# Altium schematic sheet 通用工装板02.SchDoc
size A2; Date: 20190212; CompanyName: 瑞臻信息（深圳）有限公司; DrawnBy: bob.xu; Address1: 深圳市南山区深南路万利达大厦2201室; Address2: 昆山市花桥镇花桥国际商务城绿地大道231弄9号楼杰座大厦2111室; Address3: 成都市高新区天府二街138号蜀都中心3号楼3110室; Address4: 浙江省宁波市余姚市冶山路475号1401室; Revision: V1.00; SheetOf: 2/3; ProductTitle: 通用测试工装; ModuleTitle: IO; : CheckedBy
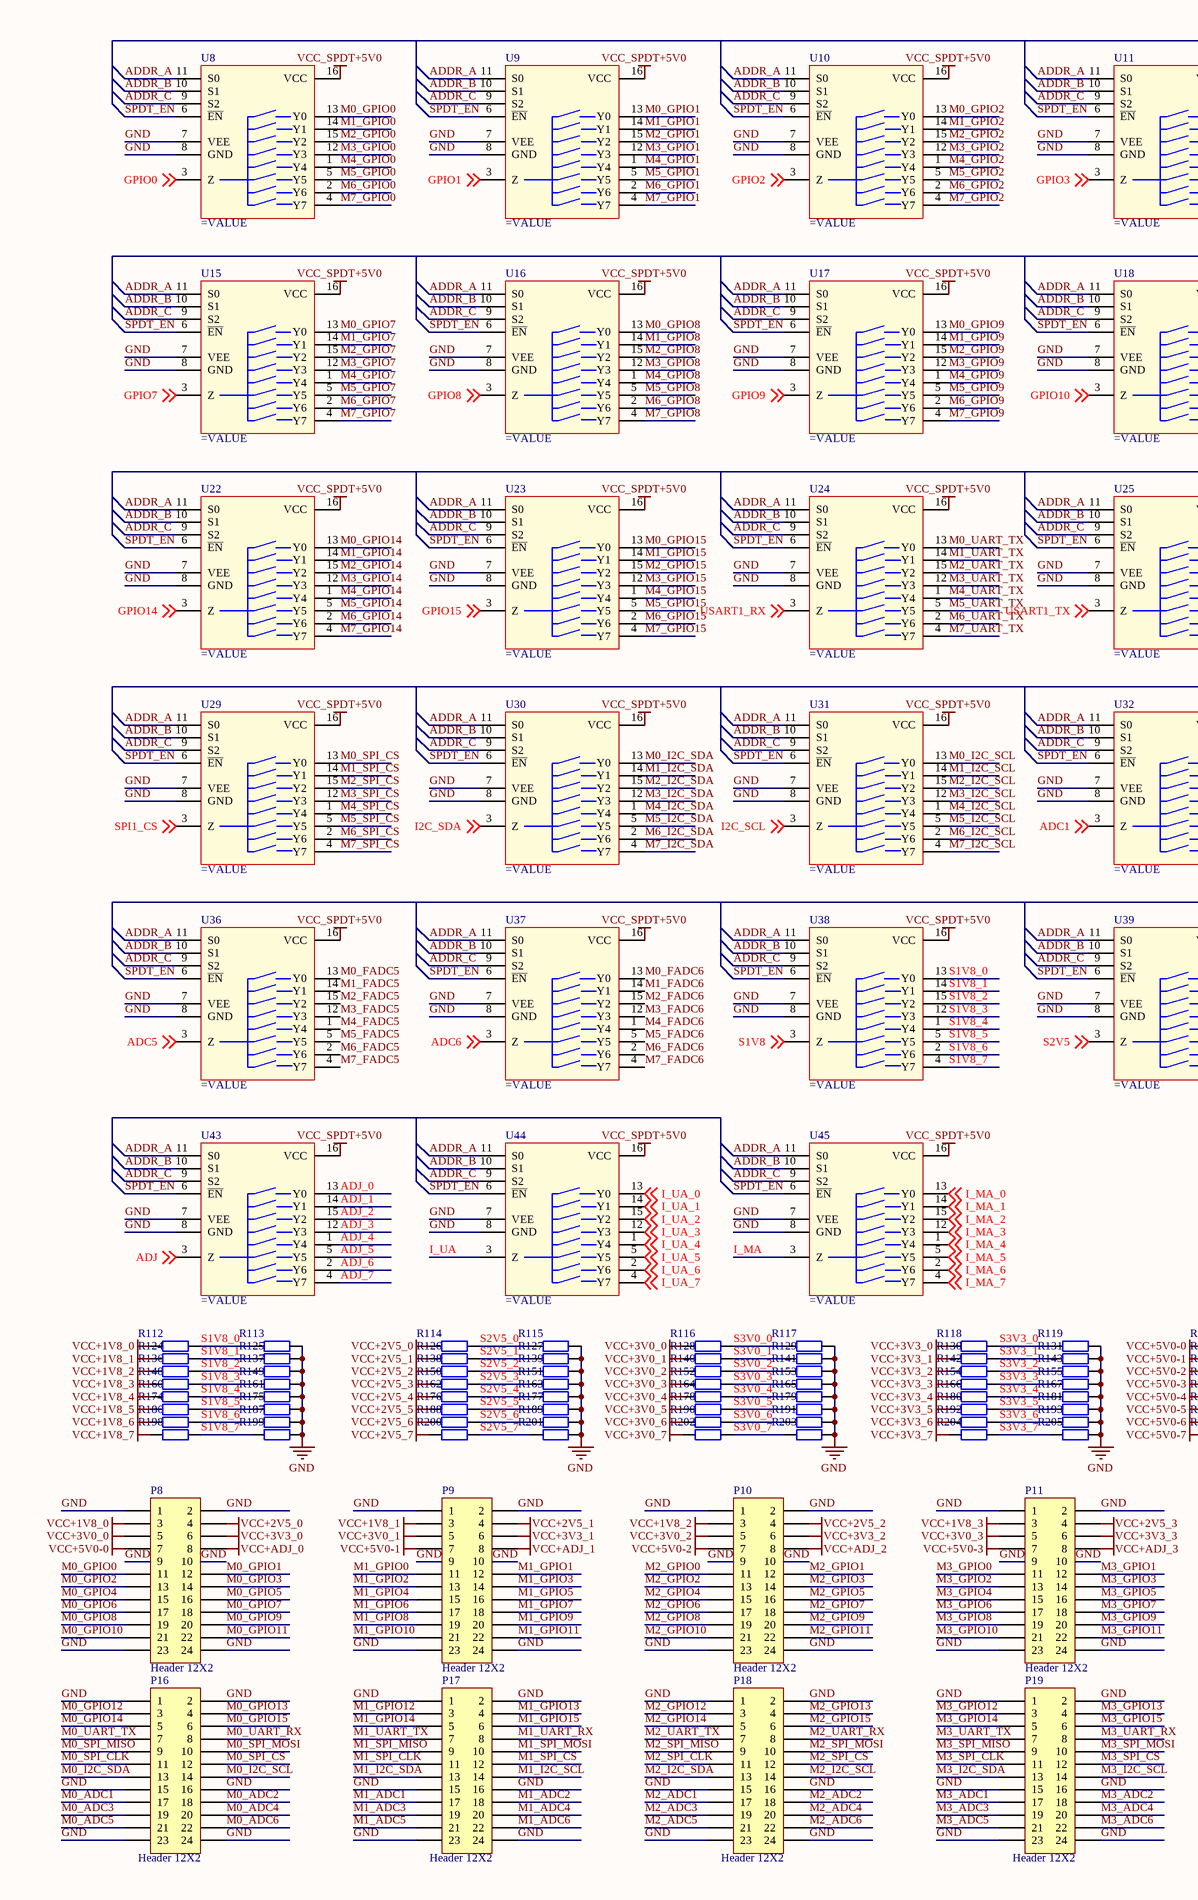
[diagram p0: 通用工装板02.SchDoc, left]
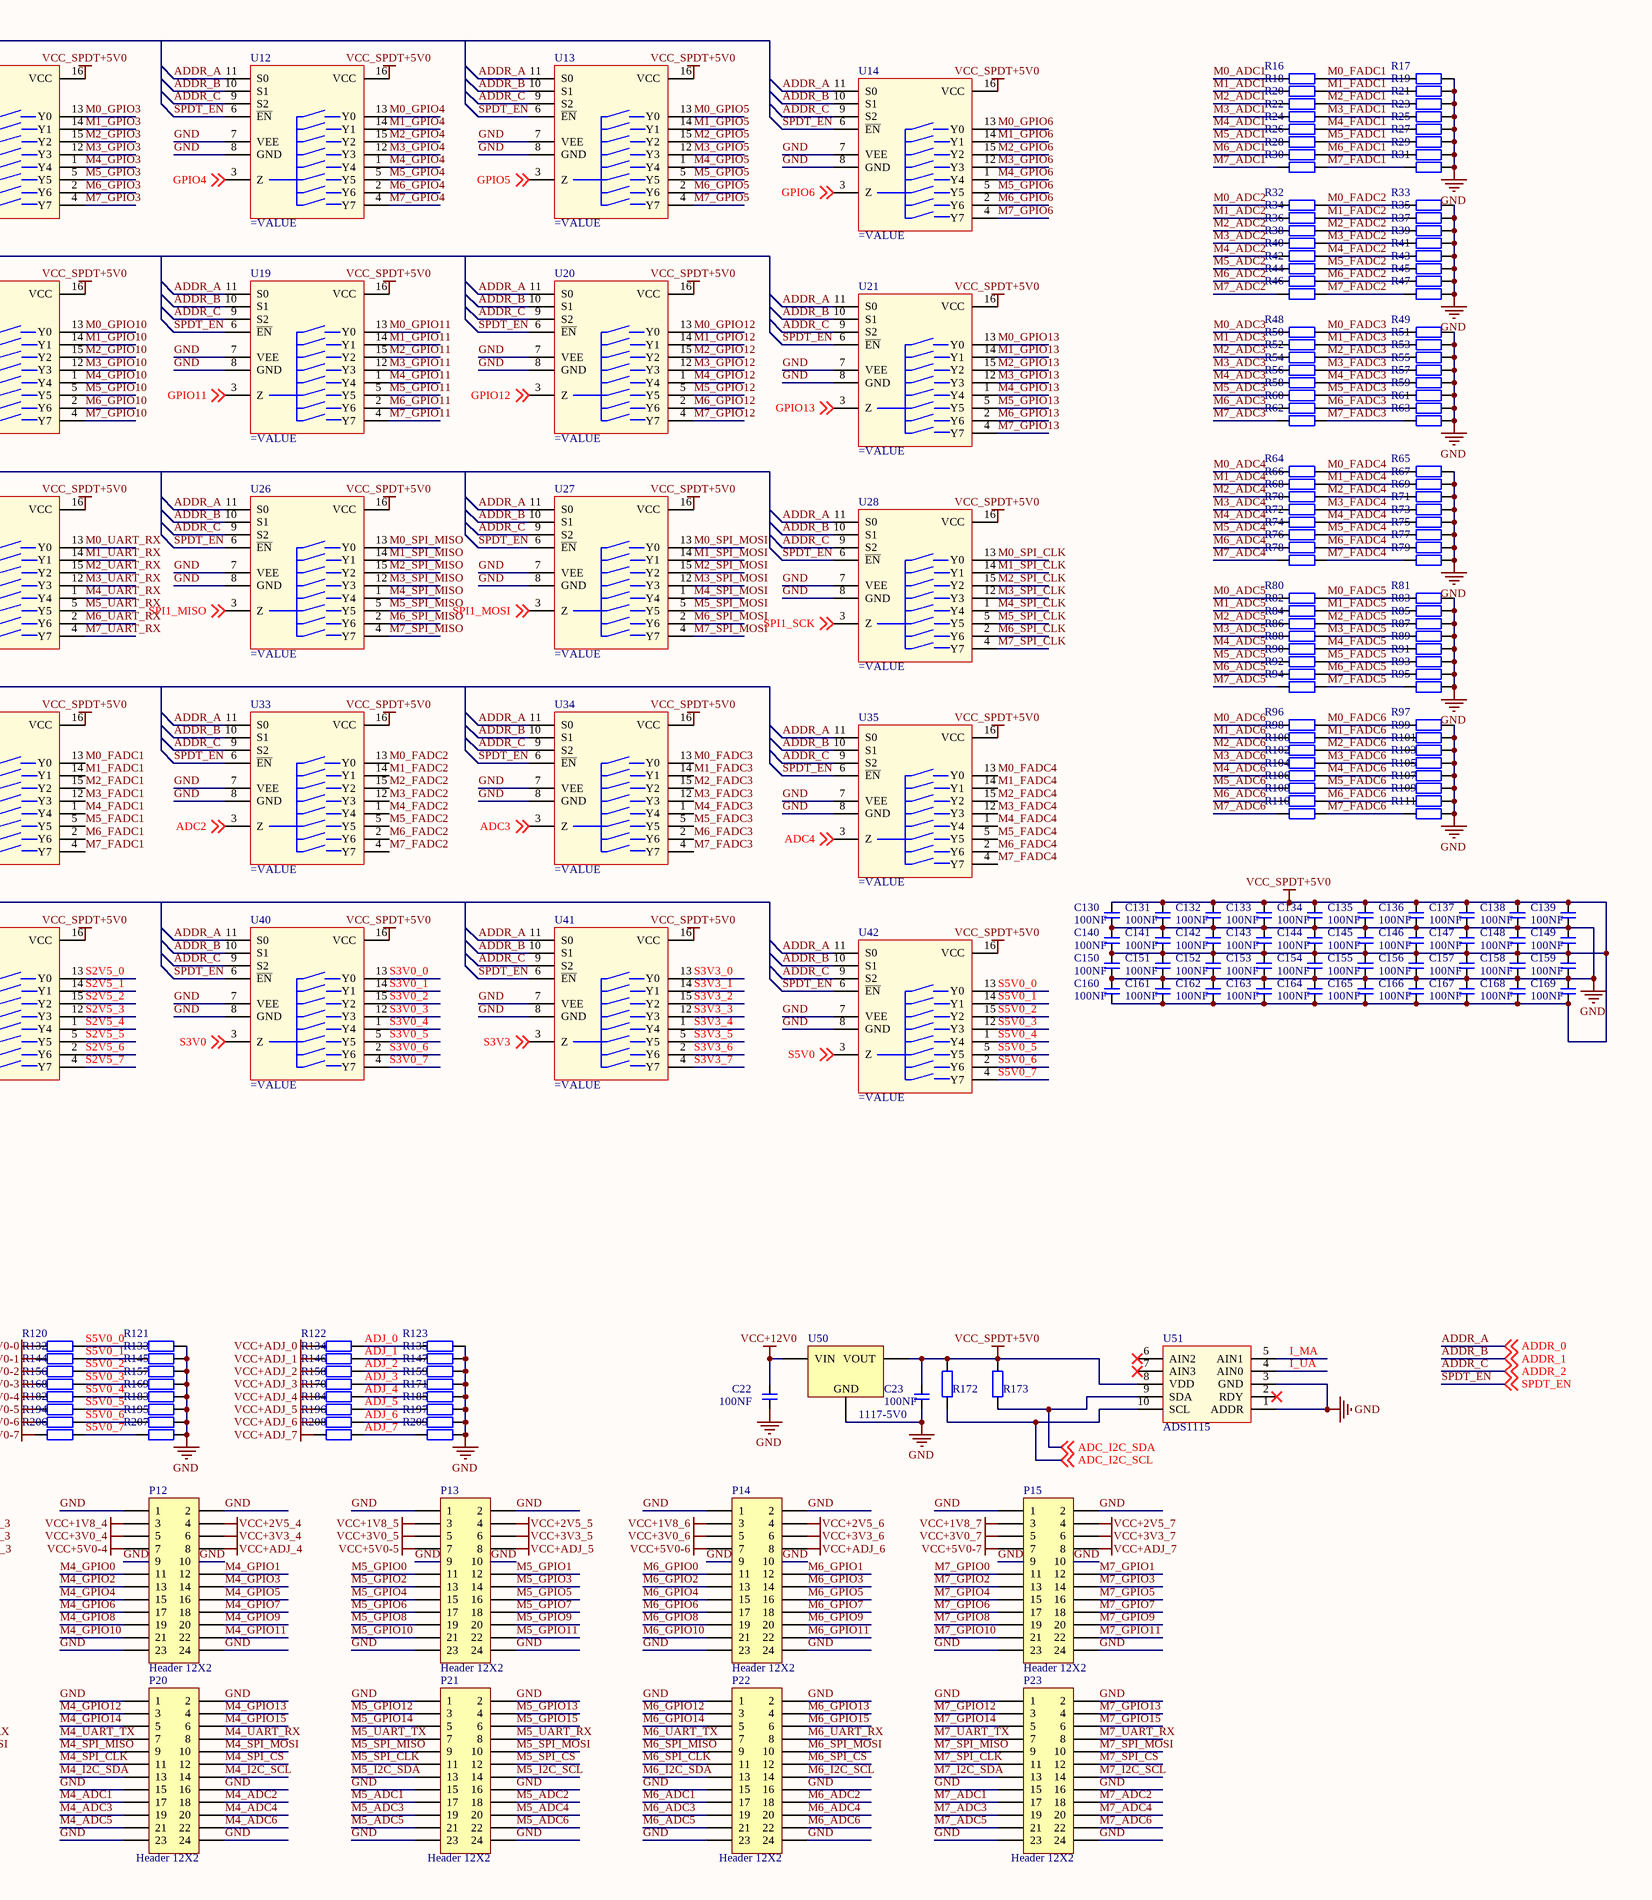
[diagram p1: 通用工装板02.SchDoc, right]

## Parts
C22  100NF  [c0402]
C23  100NF  [c0402]
C130  100NF  [c0402]
C131  100NF  [c0402]
C132  100NF  [c0402]
C133  100NF  [c0402]
C134  100NF  [c0402]
C135  100NF  [c0402]
C136  100NF  [c0402]
C137  100NF  [c0402]
C138  100NF  [c0402]
C139  100NF  [c0402]
C140  100NF  [c0402]
C141  100NF  [c0402]
C142  100NF  [c0402]
C143  100NF  [c0402]
C144  100NF  [c0402]
C145  100NF  [c0402]
C146  100NF  [c0402]
C147  100NF  [c0402]
C148  100NF  [c0402]
C149  100NF  [c0402]
C150  100NF  [c0402]
C151  100NF  [c0402]
C152  100NF  [c0402]
C153  100NF  [c0402]
C154  100NF  [c0402]
C155  100NF  [c0402]
C156  100NF  [c0402]
C157  100NF  [c0402]
C158  100NF  [c0402]
C159  100NF  [c0402]
C160  100NF  [c0402]
C161  100NF  [c0402]
C162  100NF  [c0402]
C163  100NF  [c0402]
C164  100NF  [c0402]
C165  100NF  [c0402]
C166  100NF  [c0402]
C167  100NF  [c0402]
C168  100NF  [c0402]
C169  100NF  [c0402]
P8  Header 12X2  [FPC_24P_AB_0R5_5R1X17R7]
P9  Header 12X2  [FPC_24P_AB_0R5_5R1X17R7]
P10  Header 12X2  [FPC_24P_AB_0R5_5R1X17R7]
P11  Header 12X2  [FPC_24P_AB_0R5_5R1X17R7]
P12  Header 12X2  [FPC_24P_AB_0R5_5R1X17R7]
P13  Header 12X2  [FPC_24P_AB_0R5_5R1X17R7]
P14  Header 12X2  [FPC_24P_AB_0R5_5R1X17R7]
P15  Header 12X2  [FPC_24P_AB_0R5_5R1X17R7]
P16  Header 12X2  [FPC_24P_AB_0R5_5R1X17R7]
P17  Header 12X2  [FPC_24P_AB_0R5_5R1X17R7]
P18  Header 12X2  [FPC_24P_AB_0R5_5R1X17R7]
P19  Header 12X2  [FPC_24P_AB_0R5_5R1X17R7]
P20  Header 12X2  [FPC_24P_AB_0R5_5R1X17R7]
P21  Header 12X2  [FPC_24P_AB_0R5_5R1X17R7]
P22  Header 12X2  [FPC_24P_AB_0R5_5R1X17R7]
P23  Header 12X2  [FPC_24P_AB_0R5_5R1X17R7]
R16  10K  [r0402]  (value not drawn)
R17  20K  [r0402]  (value not drawn)
R18  10K  [r0402]  (value not drawn)
R19  20K  [r0402]  (value not drawn)
R20  10K  [r0402]  (value not drawn)
R21  20K  [r0402]  (value not drawn)
R22  10K  [r0402]  (value not drawn)
R23  20K  [r0402]  (value not drawn)
R24  10K  [r0402]  (value not drawn)
R25  20K  [r0402]  (value not drawn)
R26  10K  [r0402]  (value not drawn)
R27  20K  [r0402]  (value not drawn)
R28  10K  [r0402]  (value not drawn)
R29  20K  [r0402]  (value not drawn)
R30  10K  [r0402]  (value not drawn)
R31  20K  [r0402]  (value not drawn)
R32  10K  [r0402]  (value not drawn)
R33  20K  [r0402]  (value not drawn)
R34  10K  [r0402]  (value not drawn)
R35  20K  [r0402]  (value not drawn)
R36  10K  [r0402]  (value not drawn)
R37  20K  [r0402]  (value not drawn)
R38  10K  [r0402]  (value not drawn)
R39  20K  [r0402]  (value not drawn)
R40  10K  [r0402]  (value not drawn)
R41  20K  [r0402]  (value not drawn)
R42  10K  [r0402]  (value not drawn)
R43  20K  [r0402]  (value not drawn)
R44  10K  [r0402]  (value not drawn)
R45  20K  [r0402]  (value not drawn)
R46  10K  [r0402]  (value not drawn)
R47  20K  [r0402]  (value not drawn)
R48  10K  [r0402]  (value not drawn)
R49  20K  [r0402]  (value not drawn)
R50  10K  [r0402]  (value not drawn)
R51  20K  [r0402]  (value not drawn)
R52  10K  [r0402]  (value not drawn)
R53  20K  [r0402]  (value not drawn)
R54  10K  [r0402]  (value not drawn)
R55  20K  [r0402]  (value not drawn)
R56  10K  [r0402]  (value not drawn)
R57  20K  [r0402]  (value not drawn)
R58  10K  [r0402]  (value not drawn)
R59  20K  [r0402]  (value not drawn)
R60  10K  [r0402]  (value not drawn)
R61  20K  [r0402]  (value not drawn)
R62  10K  [r0402]  (value not drawn)
R63  20K  [r0402]  (value not drawn)
R64  10K  [r0402]  (value not drawn)
R65  20K  [r0402]  (value not drawn)
R66  10K  [r0402]  (value not drawn)
R67  20K  [r0402]  (value not drawn)
R68  10K  [r0402]  (value not drawn)
R69  20K  [r0402]  (value not drawn)
R70  10K  [r0402]  (value not drawn)
R71  20K  [r0402]  (value not drawn)
R72  10K  [r0402]  (value not drawn)
R73  20K  [r0402]  (value not drawn)
R74  10K  [r0402]  (value not drawn)
R75  20K  [r0402]  (value not drawn)
R76  10K  [r0402]  (value not drawn)
R77  20K  [r0402]  (value not drawn)
R78  10K  [r0402]  (value not drawn)
R79  20K  [r0402]  (value not drawn)
R80  10K  [r0402]  (value not drawn)
R81  20K  [r0402]  (value not drawn)
R82  10K  [r0402]  (value not drawn)
R83  20K  [r0402]  (value not drawn)
R84  10K  [r0402]  (value not drawn)
R85  20K  [r0402]  (value not drawn)
R86  10K  [r0402]  (value not drawn)
R87  20K  [r0402]  (value not drawn)
R88  10K  [r0402]  (value not drawn)
R89  20K  [r0402]  (value not drawn)
R90  10K  [r0402]  (value not drawn)
R91  20K  [r0402]  (value not drawn)
R92  10K  [r0402]  (value not drawn)
R93  20K  [r0402]  (value not drawn)
R94  10K  [r0402]  (value not drawn)
R95  20K  [r0402]  (value not drawn)
R96  10K  [r0402]  (value not drawn)
R97  20K  [r0402]  (value not drawn)
R98  10K  [r0402]  (value not drawn)
R99  20K  [r0402]  (value not drawn)
R100  10K  [r0402]  (value not drawn)
R101  20K  [r0402]  (value not drawn)
R102  10K  [r0402]  (value not drawn)
R103  20K  [r0402]  (value not drawn)
R104  10K  [r0402]  (value not drawn)
R105  20K  [r0402]  (value not drawn)
R106  10K  [r0402]  (value not drawn)
R107  20K  [r0402]  (value not drawn)
R108  10K  [r0402]  (value not drawn)
R109  20K  [r0402]  (value not drawn)
R110  10K  [r0402]  (value not drawn)
R111  20K  [r0402]  (value not drawn)
R112  10K  [r0402]  (value not drawn)
R113  10K  [r0402]  (value not drawn)
R114  10K  [r0402]  (value not drawn)
R115  10K  [r0402]  (value not drawn)
R116  10K  [r0402]  (value not drawn)
R117  10K  [r0402]  (value not drawn)
R118  10K  [r0402]  (value not drawn)
R119  10K  [r0402]  (value not drawn)
R120  10K  [r0402]  (value not drawn)
R121  10K  [r0402]  (value not drawn)
R122  10K  [r0402]  (value not drawn)
R123  10K  [r0402]  (value not drawn)
R124  10K  [r0402]  (value not drawn)
R125  10K  [r0402]  (value not drawn)
R126  10K  [r0402]  (value not drawn)
R127  10K  [r0402]  (value not drawn)
R128  10K  [r0402]  (value not drawn)
R129  10K  [r0402]  (value not drawn)
R130  10K  [r0402]  (value not drawn)
R131  10K  [r0402]  (value not drawn)
R132  10K  [r0402]  (value not drawn)
R133  10K  [r0402]  (value not drawn)
R134  10K  [r0402]  (value not drawn)
R135  10K  [r0402]  (value not drawn)
R136  10K  [r0402]  (value not drawn)
R137  10K  [r0402]  (value not drawn)
R138  10K  [r0402]  (value not drawn)
R139  10K  [r0402]  (value not drawn)
R140  10K  [r0402]  (value not drawn)
R141  10K  [r0402]  (value not drawn)
R142  10K  [r0402]  (value not drawn)
R143  10K  [r0402]  (value not drawn)
R144  10K  [r0402]  (value not drawn)
R145  10K  [r0402]  (value not drawn)
R146  10K  [r0402]  (value not drawn)
R147  10K  [r0402]  (value not drawn)
R148  10K  [r0402]  (value not drawn)
R149  10K  [r0402]  (value not drawn)
R150  10K  [r0402]  (value not drawn)
R151  10K  [r0402]  (value not drawn)
R152  10K  [r0402]  (value not drawn)
R153  10K  [r0402]  (value not drawn)
R154  10K  [r0402]  (value not drawn)
R155  10K  [r0402]  (value not drawn)
R156  10K  [r0402]  (value not drawn)
R157  10K  [r0402]  (value not drawn)
R158  10K  [r0402]  (value not drawn)
R159  10K  [r0402]  (value not drawn)
R160  10K  [r0402]  (value not drawn)
R161  10K  [r0402]  (value not drawn)
R162  10K  [r0402]  (value not drawn)
R163  10K  [r0402]  (value not drawn)
R164  10K  [r0402]  (value not drawn)
R165  10K  [r0402]  (value not drawn)
R166  10K  [r0402]  (value not drawn)
R167  10K  [r0402]  (value not drawn)
R168  10K  [r0402]  (value not drawn)
R169  10K  [r0402]  (value not drawn)
R170  10K  [r0402]  (value not drawn)
R171  10K  [r0402]  (value not drawn)
R172  10K  [r0402]  (value not drawn)
R173  10K  [r0402]  (value not drawn)
R174  10K  [r0402]  (value not drawn)
R175  10K  [r0402]  (value not drawn)
R176  10K  [r0402]  (value not drawn)
R177  10K  [r0402]  (value not drawn)
R178  10K  [r0402]  (value not drawn)
R179  10K  [r0402]  (value not drawn)
R180  10K  [r0402]  (value not drawn)
R181  10K  [r0402]  (value not drawn)
R182  10K  [r0402]  (value not drawn)
R183  10K  [r0402]  (value not drawn)
R184  10K  [r0402]  (value not drawn)
R185  10K  [r0402]  (value not drawn)
R186  10K  [r0402]  (value not drawn)
R187  10K  [r0402]  (value not drawn)
R188  10K  [r0402]  (value not drawn)
R189  10K  [r0402]  (value not drawn)
R190  10K  [r0402]  (value not drawn)
R191  10K  [r0402]  (value not drawn)
R192  10K  [r0402]  (value not drawn)
R193  10K  [r0402]  (value not drawn)
R194  10K  [r0402]  (value not drawn)
R195  10K  [r0402]  (value not drawn)
R196  10K  [r0402]  (value not drawn)
R197  10K  [r0402]  (value not drawn)
R198  10K  [r0402]  (value not drawn)
R199  10K  [r0402]  (value not drawn)
R200  10K  [r0402]  (value not drawn)
R201  10K  [r0402]  (value not drawn)
R202  10K  [r0402]  (value not drawn)
R203  10K  [r0402]  (value not drawn)
R204  10K  [r0402]  (value not drawn)
R205  10K  [r0402]  (value not drawn)
R206  10K  [r0402]  (value not drawn)
R207  10K  [r0402]  (value not drawn)
R208  10K  [r0402]  (value not drawn)
R209  10K  [r0402]  (value not drawn)
U8  (no value)  [TSSOP_16P_0R65_4R4X5R0]
U9  (no value)  [TSSOP_16P_0R65_4R4X5R0]
U10  (no value)  [TSSOP_16P_0R65_4R4X5R0]
U11  (no value)  [TSSOP_16P_0R65_4R4X5R0]
U12  (no value)  [TSSOP_16P_0R65_4R4X5R0]
U13  (no value)  [TSSOP_16P_0R65_4R4X5R0]
U14  (no value)  [TSSOP_16P_0R65_4R4X5R0]
U15  (no value)  [TSSOP_16P_0R65_4R4X5R0]
U16  (no value)  [TSSOP_16P_0R65_4R4X5R0]
U17  (no value)  [TSSOP_16P_0R65_4R4X5R0]
U18  (no value)  [TSSOP_16P_0R65_4R4X5R0]
U19  (no value)  [TSSOP_16P_0R65_4R4X5R0]
U20  (no value)  [TSSOP_16P_0R65_4R4X5R0]
U21  (no value)  [TSSOP_16P_0R65_4R4X5R0]
U22  (no value)  [TSSOP_16P_0R65_4R4X5R0]
U23  (no value)  [TSSOP_16P_0R65_4R4X5R0]
U24  (no value)  [TSSOP_16P_0R65_4R4X5R0]
U25  (no value)  [TSSOP_16P_0R65_4R4X5R0]
U26  (no value)  [TSSOP_16P_0R65_4R4X5R0]
U27  (no value)  [TSSOP_16P_0R65_4R4X5R0]
U28  (no value)  [TSSOP_16P_0R65_4R4X5R0]
U29  (no value)  [TSSOP_16P_0R65_4R4X5R0]
U30  (no value)  [TSSOP_16P_0R65_4R4X5R0]
U31  (no value)  [TSSOP_16P_0R65_4R4X5R0]
U32  (no value)  [TSSOP_16P_0R65_4R4X5R0]
U33  (no value)  [TSSOP_16P_0R65_4R4X5R0]
U34  (no value)  [TSSOP_16P_0R65_4R4X5R0]
U35  (no value)  [TSSOP_16P_0R65_4R4X5R0]
U36  (no value)  [TSSOP_16P_0R65_4R4X5R0]
U37  (no value)  [TSSOP_16P_0R65_4R4X5R0]
U38  (no value)  [TSSOP_16P_0R65_4R4X5R0]
U39  (no value)  [TSSOP_16P_0R65_4R4X5R0]
U40  (no value)  [TSSOP_16P_0R65_4R4X5R0]
U41  (no value)  [TSSOP_16P_0R65_4R4X5R0]
U42  (no value)  [TSSOP_16P_0R65_4R4X5R0]
U43  (no value)  [TSSOP_16P_0R65_4R4X5R0]
U44  (no value)  [TSSOP_16P_0R65_4R4X5R0]
U45  (no value)  [TSSOP_16P_0R65_4R4X5R0]
U50  1117-5V0  [SOT223_4P_2R3_3R7X6R7]
U51  ADS1115  [MSOP_10P_3R0X5R0_P]

## Nets
GND: C22.1 C23.1 C130.1 C131.1 C132.1 C133.1 C134.1 C135.1 C136.1 C137.1 C138.1 C139.1 C140.2 C141.2 C142.2 C143.2 C144.2 C145.2 C146.2 C147.2 C148.2 C149.2 C150.1 C151.1 C152.1 C153.1 C154.1 C155.1 C156.1 C157.1 C158.1 C159.1 C160.2 C161.2 C162.2 C163.2 C164.2 C165.2 C166.2 C167.2 C168.2 C169.2 P8.1 P8.2 P8.9 P8.10 P8.23 P8.24 P9.1 P9.2 P9.9 P9.10 P9.23 P9.24 P10.1 P10.2 P10.9 P10.10 P10.23 P10.24 P11.1 P11.2 P11.9 P11.10 P11.23 P11.24 P12.1 P12.2 P12.9 P12.10 P12.23 P12.24 P13.1 P13.2 P13.9 P13.10 P13.23 P13.24 P14.1 P14.2 P14.9 P14.10 P14.23 P14.24 P15.1 P15.2 P15.9 P15.10 P15.23 P15.24 P16.1 P16.2 P16.15 P16.16 P16.23 P16.24 P17.1 P17.2 P17.15 P17.16 P17.23 P17.24 P18.1 P18.2 P18.15 P18.16 P18.23 P18.24 P19.1 P19.2 P19.15 P19.16 P19.23 P19.24 P20.1 P20.2 P20.15 P20.16 P20.23 P20.24 P21.1 P21.2 P21.15 P21.16 P21.23 P21.24 P22.1 P22.2 P22.15 P22.16 P22.23 P22.24 P23.1 P23.2 P23.15 P23.16 P23.23 P23.24 R17.2 R19.2 R21.2 R23.2 R25.2 R27.2 R29.2 R31.2 R33.2 R35.2 R37.2 R39.2 R41.2 R43.2 R45.2 R47.2 R49.2 R51.2 R53.2 R55.2 R57.2 R59.2 R61.2 R63.2 R65.2 R67.2 R69.2 R71.2 R73.2 R75.2 R77.2 R79.2 R81.2 R83.2 R85.2 R87.2 R89.2 R91.2 R93.2 R95.2 R97.2 R99.2 R101.2 R103.2 R105.2 R107.2 R109.2 R111.2 R113.2 R115.2 R117.2 R119.2 R121.2 R123.2 R125.2 R127.2 R129.2 R131.2 R133.2 R135.2 R137.2 R139.2 R141.2 R143.2 R145.2 R147.2 R149.2 R151.2 R153.2 R155.2 R157.2 R159.2 R161.2 R163.2 R165.2 R167.2 R169.2 R171.2 R175.2 R177.2 R179.2 R181.2 R183.2 R185.2 R187.2 R189.2 R191.2 R193.2 R195.2 R197.2 R199.2 R201.2 R203.2 R205.2 R207.2 R209.2 U8.7(VEE) U8.8(GND) U9.7(VEE) U9.8(GND) U10.7(VEE) U10.8(GND) U11.7(VEE) U11.8(GND) U12.7(VEE) U12.8(GND) U13.7(VEE) U13.8(GND) U14.7(VEE) U14.8(GND) U15.7(VEE) U15.8(GND) U16.7(VEE) U16.8(GND) U17.7(VEE) U17.8(GND) U18.7(VEE) U18.8(GND) U19.7(VEE) U19.8(GND) U20.7(VEE) U20.8(GND) U21.7(VEE) U21.8(GND) U22.7(VEE) U22.8(GND) U23.7(VEE) U23.8(GND) U24.7(VEE) U24.8(GND) U25.7(VEE) U25.8(GND) U26.7(VEE) U26.8(GND) U27.7(VEE) U27.8(GND) U28.7(VEE) U28.8(GND) U29.7(VEE) U29.8(GND) U30.7(VEE) U30.8(GND) U31.7(VEE) U31.8(GND) U32.7(VEE) U32.8(GND) U33.7(VEE) U33.8(GND) U34.7(VEE) U34.8(GND) U35.7(VEE) U35.8(GND) U36.7(VEE) U36.8(GND) U37.7(VEE) U37.8(GND) U38.7(VEE) U38.8(GND) U39.7(VEE) U39.8(GND) U40.7(VEE) U40.8(GND) U41.7(VEE) U41.8(GND) U42.7(VEE) U42.8(GND) U43.7(VEE) U43.8(GND) U44.7(VEE) U44.8(GND) U45.7(VEE) U45.8(GND) U50.1(GND) U51.1(ADDR) U51.3(GND)
VCC+1V8_0: P8.3 R112.1
VCC+1V8_1: P9.3 R124.1
VCC+1V8_2: P10.3 R136.1
VCC+1V8_3: P11.3 R148.1
VCC+1V8_4: P12.3 R160.1
VCC+1V8_5: P13.3 R174.1
VCC+1V8_6: P14.3 R186.1
VCC+1V8_7: P15.3 R198.1
VCC+2V5_0: P8.4 R114.1
VCC+2V5_1: P9.4 R126.1
VCC+2V5_2: P10.4 R138.1
VCC+2V5_3: P11.4 R150.1
VCC+2V5_4: P12.4 R162.1
VCC+2V5_5: P13.4 R176.1
VCC+2V5_6: P14.4 R188.1
VCC+2V5_7: P15.4 R200.1
VCC+3V0_0: P8.5 R116.1
VCC+3V0_1: P9.5 R128.1
VCC+3V0_2: P10.5 R140.1
VCC+3V0_3: P11.5 R152.1
VCC+3V0_4: P12.5 R164.1
VCC+3V0_5: P13.5 R178.1
VCC+3V0_6: P14.5 R190.1
VCC+3V0_7: P15.5 R202.1
VCC+3V3_0: P8.6 R118.1
VCC+3V3_1: P9.6 R130.1
VCC+3V3_2: P10.6 R142.1
VCC+3V3_3: P11.6 R154.1
VCC+3V3_4: P12.6 R166.1
VCC+3V3_5: P13.6 R180.1
VCC+3V3_6: P14.6 R192.1
VCC+3V3_7: P15.6 R204.1
VCC+5V0-0: P8.7 R120.1
VCC+5V0-1: P9.7 R132.1
VCC+5V0-2: P10.7 R144.1
VCC+5V0-3: P11.7 R156.1
VCC+5V0-4: P12.7 R168.1
VCC+5V0-5: P13.7 R182.1
VCC+5V0-6: P14.7 R194.1
VCC+5V0-7: P15.7 R206.1
VCC+12V0: C22.2 U50.3(VIN)
VCC+ADJ_0: P8.8 R122.1
VCC+ADJ_1: P9.8 R134.1
VCC+ADJ_2: P10.8 R146.1
VCC+ADJ_3: P11.8 R158.1
VCC+ADJ_4: P12.8 R170.1
VCC+ADJ_5: P13.8 R184.1
VCC+ADJ_6: P14.8 R196.1
VCC+ADJ_7: P15.8 R208.1
VCC_SPDT+5V0: C23.2 C130.2 C131.2 C132.2 C133.2 C134.2 C135.2 C136.2 C137.2 C138.2 C139.2 C140.1 C141.1 C142.1 C143.1 C144.1 C145.1 C146.1 C147.1 C148.1 C149.1 C150.2 C151.2 C152.2 C153.2 C154.2 C155.2 C156.2 C157.2 C158.2 C159.2 C160.1 C161.1 C162.1 C163.1 C164.1 C165.1 C166.1 C167.1 C168.1 C169.1 R172.2 R173.2 U8.16(VCC) U9.16(VCC) U10.16(VCC) U11.16(VCC) U12.16(VCC) U13.16(VCC) U14.16(VCC) U15.16(VCC) U16.16(VCC) U17.16(VCC) U18.16(VCC) U19.16(VCC) U20.16(VCC) U21.16(VCC) U22.16(VCC) U23.16(VCC) U24.16(VCC) U25.16(VCC) U26.16(VCC) U27.16(VCC) U28.16(VCC) U29.16(VCC) U30.16(VCC) U31.16(VCC) U32.16(VCC) U33.16(VCC) U34.16(VCC) U35.16(VCC) U36.16(VCC) U37.16(VCC) U38.16(VCC) U39.16(VCC) U40.16(VCC) U41.16(VCC) U42.16(VCC) U43.16(VCC) U44.16(VCC) U45.16(VCC) U50.2(VOUT) U51.8(VDD)
ADC1: U32.3(Z) ; off-sheet ADC1
ADC2: U33.3(Z) ; off-sheet ADC2
ADC3: U34.3(Z) ; off-sheet ADC3
ADC4: U35.3(Z) ; off-sheet ADC4
ADC5: U36.3(Z) ; off-sheet ADC5
ADC6: U37.3(Z) ; off-sheet ADC6
ADC_I2C_SCL: R172.1 U51.10(SCL) ; off-sheet ADC_I2C_SCL
ADC_I2C_SDA: R173.1 U51.9(SDA) ; off-sheet ADC_I2C_SDA
ADDR_A: U8.11(S0) U9.11(S0) U10.11(S0) U11.11(S0) U12.11(S0) U13.11(S0) U14.11(S0) U15.11(S0) U16.11(S0) U17.11(S0) U18.11(S0) U19.11(S0) U20.11(S0) U21.11(S0) U22.11(S0) U23.11(S0) U24.11(S0) U25.11(S0) U26.11(S0) U27.11(S0) U28.11(S0) U29.11(S0) U30.11(S0) U31.11(S0) U32.11(S0) U33.11(S0) U34.11(S0) U35.11(S0) U36.11(S0) U37.11(S0) U38.11(S0) U39.11(S0) U40.11(S0) U41.11(S0) U42.11(S0) U43.11(S0) U44.11(S0) U45.11(S0) ; off-sheet ADDR_0  [also labelled ADDR_0]
ADDR_B: U8.10(S1) U9.10(S1) U10.10(S1) U11.10(S1) U12.10(S1) U13.10(S1) U14.10(S1) U15.10(S1) U16.10(S1) U17.10(S1) U18.10(S1) U19.10(S1) U20.10(S1) U21.10(S1) U22.10(S1) U23.10(S1) U24.10(S1) U25.10(S1) U26.10(S1) U27.10(S1) U28.10(S1) U29.10(S1) U30.10(S1) U31.10(S1) U32.10(S1) U33.10(S1) U34.10(S1) U35.10(S1) U36.10(S1) U37.10(S1) U38.10(S1) U39.10(S1) U40.10(S1) U41.10(S1) U42.10(S1) U43.10(S1) U44.10(S1) U45.10(S1) ; off-sheet ADDR_1  [also labelled ADDR_1]
ADDR_C: U8.9(S2) U9.9(S2) U10.9(S2) U11.9(S2) U12.9(S2) U13.9(S2) U14.9(S2) U15.9(S2) U16.9(S2) U17.9(S2) U18.9(S2) U19.9(S2) U20.9(S2) U21.9(S2) U22.9(S2) U23.9(S2) U24.9(S2) U25.9(S2) U26.9(S2) U27.9(S2) U28.9(S2) U29.9(S2) U30.9(S2) U31.9(S2) U32.9(S2) U33.9(S2) U34.9(S2) U35.9(S2) U36.9(S2) U37.9(S2) U38.9(S2) U39.9(S2) U40.9(S2) U41.9(S2) U42.9(S2) U43.9(S2) U44.9(S2) U45.9(S2) ; off-sheet ADDR_2  [also labelled ADDR_2]
ADJ: U43.3(Z) ; off-sheet ADJ
ADJ_0: R122.2 R123.1 U43.13(Y0)
ADJ_1: R134.2 R135.1 U43.14(Y1)
ADJ_2: R146.2 R147.1 U43.15(Y2)
ADJ_3: R158.2 R159.1 U43.12(Y3)
ADJ_4: R170.2 R171.1 U43.1(Y4)
ADJ_5: R184.2 R185.1 U43.5(Y5)
ADJ_6: R196.2 R197.1 U43.2(Y6)
ADJ_7: R208.2 R209.1 U43.4(Y7)
GPIO0: U8.3(Z) ; off-sheet GPIO0
GPIO1: U9.3(Z) ; off-sheet GPIO1
GPIO2: U10.3(Z) ; off-sheet GPIO2
GPIO3: U11.3(Z) ; off-sheet GPIO3
GPIO4: U12.3(Z) ; off-sheet GPIO4
GPIO5: U13.3(Z) ; off-sheet GPIO5
GPIO6: U14.3(Z) ; off-sheet GPIO6
GPIO7: U15.3(Z) ; off-sheet GPIO7
GPIO8: U16.3(Z) ; off-sheet GPIO8
GPIO9: U17.3(Z) ; off-sheet GPIO9
GPIO10: U18.3(Z) ; off-sheet GPIO10
GPIO11: U19.3(Z) ; off-sheet GPIO11
GPIO12: U20.3(Z) ; off-sheet GPIO12
GPIO13: U21.3(Z) ; off-sheet GPIO13
GPIO14: U22.3(Z) ; off-sheet GPIO14
GPIO15: U23.3(Z) ; off-sheet GPIO15
I2C_SCL: U31.3(Z) ; off-sheet I2C_SCL
I2C_SDA: U30.3(Z) ; off-sheet I2C_SDA
I_MA: U45.3(Z) U51.5(AIN1)
I_MA_0: U45.13(Y0) ; off-sheet I_MA_0
I_MA_1: U45.14(Y1) ; off-sheet I_MA_1
I_MA_2: U45.15(Y2) ; off-sheet I_MA_2
I_MA_3: U45.12(Y3) ; off-sheet I_MA_3
I_MA_4: U45.1(Y4) ; off-sheet I_MA_4
I_MA_5: U45.5(Y5) ; off-sheet I_MA_5
I_MA_6: U45.2(Y6) ; off-sheet I_MA_6
I_MA_7: U45.4(Y7) ; off-sheet I_MA_7
I_UA: U44.3(Z) U51.4(AIN0)
I_UA_0: U44.13(Y0) ; off-sheet I_UA_0
I_UA_1: U44.14(Y1) ; off-sheet I_UA_1
I_UA_2: U44.15(Y2) ; off-sheet I_UA_2
I_UA_3: U44.12(Y3) ; off-sheet I_UA_3
I_UA_4: U44.1(Y4) ; off-sheet I_UA_4
I_UA_5: U44.5(Y5) ; off-sheet I_UA_5
I_UA_6: U44.2(Y6) ; off-sheet I_UA_6
I_UA_7: U44.4(Y7) ; off-sheet I_UA_7
M0_ADC1: P16.17 R16.1
M0_ADC2: P16.18 R32.1
M0_ADC3: P16.19 R48.1
M0_ADC4: P16.20 R64.1
M0_ADC5: P16.21 R80.1
M0_ADC6: P16.22 R96.1
M0_FADC1: R16.2 R17.1 U32.13(Y0)
M0_FADC2: R32.2 R33.1 U33.13(Y0)
M0_FADC3: R48.2 R49.1 U34.13(Y0)
M0_FADC4: R64.2 R65.1 U35.13(Y0)
M0_FADC5: R80.2 R81.1 U36.13(Y0)
M0_FADC6: R96.2 R97.1 U37.13(Y0)
M0_GPIO0: P8.11 U8.13(Y0)
M0_GPIO1: P8.12 U9.13(Y0)
M0_GPIO2: P8.13 U10.13(Y0)
M0_GPIO3: P8.14 U11.13(Y0)
M0_GPIO4: P8.15 U12.13(Y0)
M0_GPIO5: P8.16 U13.13(Y0)
M0_GPIO6: P8.17 U14.13(Y0)
M0_GPIO7: P8.18 U15.13(Y0)
M0_GPIO8: P8.19 U16.13(Y0)
M0_GPIO9: P8.20 U17.13(Y0)
M0_GPIO10: P8.21 U18.13(Y0)
M0_GPIO11: P8.22 U19.13(Y0)
M0_GPIO12: P16.3 U20.13(Y0)
M0_GPIO13: P16.4 U21.13(Y0)
M0_GPIO14: P16.5 U22.13(Y0)
M0_GPIO15: P16.6 U23.13(Y0)
M0_I2C_SCL: P16.14 U31.13(Y0)
M0_I2C_SDA: P16.13 U30.13(Y0)
M0_SPI_CLK: P16.11 U28.13(Y0)
M0_SPI_CS: P16.12 U29.13(Y0)
M0_SPI_MISO: P16.9 U26.13(Y0)
M0_SPI_MOSI: P16.10 U27.13(Y0)
M0_UART_RX: P16.8 U25.13(Y0)
M0_UART_TX: P16.7 U24.13(Y0)
M1_ADC1: P17.17 R18.1
M1_ADC2: P17.18 R34.1
M1_ADC3: P17.19 R50.1
M1_ADC4: P17.20 R66.1
M1_ADC5: P17.21 R82.1
M1_ADC6: P17.22 R98.1
M1_FADC1: R18.2 R19.1 U32.14(Y1)
M1_FADC2: R34.2 R35.1 U33.14(Y1)
M1_FADC3: R50.2 R51.1 U34.14(Y1)
M1_FADC4: R66.2 R67.1 U35.14(Y1)
M1_FADC5: R82.2 R83.1 U36.14(Y1)
M1_FADC6: R98.2 R99.1 U37.14(Y1)
M1_GPIO0: P9.11 U8.14(Y1)
M1_GPIO1: P9.12 U9.14(Y1)
M1_GPIO2: P9.13 U10.14(Y1)
M1_GPIO3: P9.14 U11.14(Y1)
M1_GPIO4: P9.15 U12.14(Y1)
M1_GPIO5: P9.16 U13.14(Y1)
M1_GPIO6: P9.17 U14.14(Y1)
M1_GPIO7: P9.18 U15.14(Y1)
M1_GPIO8: P9.19 U16.14(Y1)
M1_GPIO9: P9.20 U17.14(Y1)
M1_GPIO10: P9.21 U18.14(Y1)
M1_GPIO11: P9.22 U19.14(Y1)
M1_GPIO12: P17.3 U20.14(Y1)
M1_GPIO13: P17.4 U21.14(Y1)
M1_GPIO14: P17.5 U22.14(Y1)
M1_GPIO15: P17.6 U23.14(Y1)
M1_I2C_SCL: P17.14 U31.14(Y1)
M1_I2C_SDA: P17.13 U30.14(Y1)
M1_SPI_CLK: P17.11 U28.14(Y1)
M1_SPI_CS: P17.12 U29.14(Y1)
M1_SPI_MISO: P17.9 U26.14(Y1)
M1_SPI_MOSI: P17.10 U27.14(Y1)
M1_UART_RX: P17.8 U25.14(Y1)
M1_UART_TX: P17.7 U24.14(Y1)
M2_ADC1: P18.17 R20.1
M2_ADC2: P18.18 R36.1
M2_ADC3: P18.19 R52.1
M2_ADC4: P18.20 R68.1
M2_ADC5: P18.21 R84.1
M2_ADC6: P18.22 R100.1
M2_FADC1: R20.2 R21.1 U32.15(Y2)
M2_FADC2: R36.2 R37.1 U33.15(Y2)
M2_FADC3: R52.2 R53.1 U34.15(Y2)
M2_FADC4: R68.2 R69.1 U35.15(Y2)
M2_FADC5: R84.2 R85.1 U36.15(Y2)
M2_FADC6: R100.2 R101.1 U37.15(Y2)
M2_GPIO0: P10.11 U8.15(Y2)
M2_GPIO1: P10.12 U9.15(Y2)
M2_GPIO2: P10.13 U10.15(Y2)
M2_GPIO3: P10.14 U11.15(Y2)
M2_GPIO4: P10.15 U12.15(Y2)
M2_GPIO5: P10.16 U13.15(Y2)
M2_GPIO6: P10.17 U14.15(Y2)
M2_GPIO7: P10.18 U15.15(Y2)
M2_GPIO8: P10.19 U16.15(Y2)
M2_GPIO9: P10.20 U17.15(Y2)
M2_GPIO10: P10.21 U18.15(Y2)
M2_GPIO11: P10.22 U19.15(Y2)
M2_GPIO12: P18.3 U20.15(Y2)
M2_GPIO13: P18.4 U21.15(Y2)
M2_GPIO14: P18.5 U22.15(Y2)
M2_GPIO15: P18.6 U23.15(Y2)
M2_I2C_SCL: P18.14 U31.15(Y2)
M2_I2C_SDA: P18.13 U30.15(Y2)
M2_SPI_CLK: P18.11 U28.15(Y2)
M2_SPI_CS: P18.12 U29.15(Y2)
M2_SPI_MISO: P18.9 U26.15(Y2)
M2_SPI_MOSI: P18.10 U27.15(Y2)
M2_UART_RX: P18.8 U25.15(Y2)
M2_UART_TX: P18.7 U24.15(Y2)
M3_ADC1: P19.17 R22.1
M3_ADC2: P19.18 R38.1
M3_ADC3: P19.19 R54.1
M3_ADC4: P19.20 R70.1
M3_ADC5: P19.21 R86.1
M3_ADC6: P19.22 R102.1
M3_FADC1: R22.2 R23.1 U32.12(Y3)
M3_FADC2: R38.2 R39.1 U33.12(Y3)
M3_FADC3: R54.2 R55.1 U34.12(Y3)
M3_FADC4: R70.2 R71.1 U35.12(Y3)
M3_FADC5: R86.2 R87.1 U36.12(Y3)
M3_FADC6: R102.2 R103.1 U37.12(Y3)
M3_GPIO0: P11.11 U8.12(Y3)
M3_GPIO1: P11.12 U9.12(Y3)
M3_GPIO2: P11.13 U10.12(Y3)
M3_GPIO3: P11.14 U11.12(Y3)
M3_GPIO4: P11.15 U12.12(Y3)
M3_GPIO5: P11.16 U13.12(Y3)
M3_GPIO6: P11.17 U14.12(Y3)
M3_GPIO7: P11.18 U15.12(Y3)
M3_GPIO8: P11.19 U16.12(Y3)
M3_GPIO9: P11.20 U17.12(Y3)
M3_GPIO10: P11.21 U18.12(Y3)
M3_GPIO11: P11.22 U19.12(Y3)
M3_GPIO12: P19.3 U20.12(Y3)
M3_GPIO13: P19.4 U21.12(Y3)
M3_GPIO14: P19.5 U22.12(Y3)
M3_GPIO15: P19.6 U23.12(Y3)
M3_I2C_SCL: P19.14 U31.12(Y3)
M3_I2C_SDA: P19.13 U30.12(Y3)
M3_SPI_CLK: P19.11 U28.12(Y3)
M3_SPI_CS: P19.12 U29.12(Y3)
M3_SPI_MISO: P19.9 U26.12(Y3)
M3_SPI_MOSI: P19.10 U27.12(Y3)
M3_UART_RX: P19.8 U25.12(Y3)
M3_UART_TX: P19.7 U24.12(Y3)
M4_ADC1: P20.17 R24.1
M4_ADC2: P20.18 R40.1
M4_ADC3: P20.19 R56.1
M4_ADC4: P20.20 R72.1
M4_ADC5: P20.21 R88.1
M4_ADC6: P20.22 R104.1
M4_FADC1: R24.2 R25.1 U32.1(Y4)
M4_FADC2: R40.2 R41.1 U33.1(Y4)
M4_FADC3: R56.2 R57.1 U34.1(Y4)
M4_FADC4: R72.2 R73.1 U35.1(Y4)
M4_FADC5: R88.2 R89.1 U36.1(Y4)
M4_FADC6: R104.2 R105.1 U37.1(Y4)
M4_GPIO0: P12.11 U8.1(Y4)
M4_GPIO1: P12.12 U9.1(Y4)
M4_GPIO2: P12.13 U10.1(Y4)
M4_GPIO3: P12.14 U11.1(Y4)
M4_GPIO4: P12.15 U12.1(Y4)
M4_GPIO5: P12.16 U13.1(Y4)
M4_GPIO6: P12.17 U14.1(Y4)
M4_GPIO7: P12.18 U15.1(Y4)
M4_GPIO8: P12.19 U16.1(Y4)
M4_GPIO9: P12.20 U17.1(Y4)
M4_GPIO10: P12.21 U18.1(Y4)
M4_GPIO11: P12.22 U19.1(Y4)
M4_GPIO12: P20.3 U20.1(Y4)
M4_GPIO13: P20.4 U21.1(Y4)
M4_GPIO14: P20.5 U22.1(Y4)
M4_GPIO15: P20.6 U23.1(Y4)
M4_I2C_SCL: P20.14 U31.1(Y4)
M4_I2C_SDA: P20.13 U30.1(Y4)
M4_SPI_CLK: P20.11 U28.1(Y4)
M4_SPI_CS: P20.12 U29.1(Y4)
M4_SPI_MISO: P20.9 U26.1(Y4)
M4_SPI_MOSI: P20.10 U27.1(Y4)
M4_UART_RX: P20.8 U25.1(Y4)
M4_UART_TX: P20.7 U24.1(Y4)
M5_ADC1: P21.17 R26.1
M5_ADC2: P21.18 R42.1
M5_ADC3: P21.19 R58.1
M5_ADC4: P21.20 R74.1
M5_ADC5: P21.21 R90.1
M5_ADC6: P21.22 R106.1
M5_FADC1: R26.2 R27.1 U32.5(Y5)
M5_FADC2: R42.2 R43.1 U33.5(Y5)
M5_FADC3: R58.2 R59.1 U34.5(Y5)
M5_FADC4: R74.2 R75.1 U35.5(Y5)
M5_FADC5: R90.2 R91.1 U36.5(Y5)
M5_FADC6: R106.2 R107.1 U37.5(Y5)
M5_GPIO0: P13.11 U8.5(Y5)
M5_GPIO1: P13.12 U9.5(Y5)
M5_GPIO2: P13.13 U10.5(Y5)
M5_GPIO3: P13.14 U11.5(Y5)
M5_GPIO4: P13.15 U12.5(Y5)
M5_GPIO5: P13.16 U13.5(Y5)
M5_GPIO6: P13.17 U14.5(Y5)
M5_GPIO7: P13.18 U15.5(Y5)
M5_GPIO8: P13.19 U16.5(Y5)
M5_GPIO9: P13.20 U17.5(Y5)
M5_GPIO10: P13.21 U18.5(Y5)
M5_GPIO11: P13.22 U19.5(Y5)
M5_GPIO12: P21.3 U20.5(Y5)
M5_GPIO13: P21.4 U21.5(Y5)
M5_GPIO14: P21.5 U22.5(Y5)
M5_GPIO15: P21.6 U23.5(Y5)
M5_I2C_SCL: P21.14 U31.5(Y5)
M5_I2C_SDA: P21.13 U30.5(Y5)
M5_SPI_CLK: P21.11 U28.5(Y5)
M5_SPI_CS: P21.12 U29.5(Y5)
M5_SPI_MISO: P21.9 U26.5(Y5)
M5_SPI_MOSI: P21.10 U27.5(Y5)
M5_UART_RX: P21.8 U25.5(Y5)
M5_UART_TX: P21.7 U24.5(Y5)
M6_ADC1: P22.17 R28.1
M6_ADC2: P22.18 R44.1
M6_ADC3: P22.19 R60.1
M6_ADC4: P22.20 R76.1
M6_ADC5: P22.21 R92.1
M6_ADC6: P22.22 R108.1
M6_FADC1: R28.2 R29.1 U32.2(Y6)
M6_FADC2: R44.2 R45.1 U33.2(Y6)
M6_FADC3: R60.2 R61.1 U34.2(Y6)
M6_FADC4: R76.2 R77.1 U35.2(Y6)
M6_FADC5: R92.2 R93.1 U36.2(Y6)
M6_FADC6: R108.2 R109.1 U37.2(Y6)
M6_GPIO0: P14.11 U8.2(Y6)
M6_GPIO1: P14.12 U9.2(Y6)
M6_GPIO2: P14.13 U10.2(Y6)
M6_GPIO3: P14.14 U11.2(Y6)
M6_GPIO4: P14.15 U12.2(Y6)
M6_GPIO5: P14.16 U13.2(Y6)
M6_GPIO6: P14.17 U14.2(Y6)
M6_GPIO7: P14.18 U15.2(Y6)
M6_GPIO8: P14.19 U16.2(Y6)
M6_GPIO9: P14.20 U17.2(Y6)
M6_GPIO10: P14.21 U18.2(Y6)
M6_GPIO11: P14.22 U19.2(Y6)
M6_GPIO12: P22.3 U20.2(Y6)
M6_GPIO13: P22.4 U21.2(Y6)
M6_GPIO14: P22.5 U22.2(Y6)
M6_GPIO15: P22.6 U23.2(Y6)
M6_I2C_SCL: P22.14 U31.2(Y6)
M6_I2C_SDA: P22.13 U30.2(Y6)
M6_SPI_CLK: P22.11 U28.2(Y6)
M6_SPI_CS: P22.12 U29.2(Y6)
M6_SPI_MISO: P22.9 U26.2(Y6)
M6_SPI_MOSI: P22.10 U27.2(Y6)
M6_UART_RX: P22.8 U25.2(Y6)
M6_UART_TX: P22.7 U24.2(Y6)
M7_ADC1: P23.17 R30.1
M7_ADC2: P23.18 R46.1
M7_ADC3: P23.19 R62.1
M7_ADC4: P23.20 R78.1
M7_ADC5: P23.21 R94.1
M7_ADC6: P23.22 R110.1
M7_FADC1: R30.2 R31.1 U32.4(Y7)
M7_FADC2: R46.2 R47.1 U33.4(Y7)
M7_FADC3: R62.2 R63.1 U34.4(Y7)
M7_FADC4: R78.2 R79.1 U35.4(Y7)
M7_FADC5: R94.2 R95.1 U36.4(Y7)
M7_FADC6: R110.2 R111.1 U37.4(Y7)
M7_GPIO0: P15.11 U8.4(Y7)
M7_GPIO1: P15.12 U9.4(Y7)
M7_GPIO2: P15.13 U10.4(Y7)
M7_GPIO3: P15.14 U11.4(Y7)
M7_GPIO4: P15.15 U12.4(Y7)
M7_GPIO5: P15.16 U13.4(Y7)
M7_GPIO6: P15.17 U14.4(Y7)
M7_GPIO7: P15.18 U15.4(Y7)
M7_GPIO8: P15.19 U16.4(Y7)
M7_GPIO9: P15.20 U17.4(Y7)
M7_GPIO10: P15.21 U18.4(Y7)
M7_GPIO11: P15.22 U19.4(Y7)
M7_GPIO12: P23.3 U20.4(Y7)
M7_GPIO13: P23.4 U21.4(Y7)
M7_GPIO14: P23.5 U22.4(Y7)
M7_GPIO15: P23.6 U23.4(Y7)
M7_I2C_SCL: P23.14 U31.4(Y7)
M7_I2C_SDA: P23.13 U30.4(Y7)
M7_SPI_CLK: P23.11 U28.4(Y7)
M7_SPI_CS: P23.12 U29.4(Y7)
M7_SPI_MISO: P23.9 U26.4(Y7)
M7_SPI_MOSI: P23.10 U27.4(Y7)
M7_UART_RX: P23.8 U25.4(Y7)
M7_UART_TX: P23.7 U24.4(Y7)
S1V8: U38.3(Z) ; off-sheet S1V8
S1V8_0: R112.2 R113.1 U38.13(Y0)
S1V8_1: R124.2 R125.1 U38.14(Y1)
S1V8_2: R136.2 R137.1 U38.15(Y2)
S1V8_3: R148.2 R149.1 U38.12(Y3)
S1V8_4: R160.2 R161.1 U38.1(Y4)
S1V8_5: R174.2 R175.1 U38.5(Y5)
S1V8_6: R186.2 R187.1 U38.2(Y6)
S1V8_7: R198.2 R199.1 U38.4(Y7)
S2V5: U39.3(Z) ; off-sheet S2V5
S2V5_0: R114.2 R115.1 U39.13(Y0)
S2V5_1: R126.2 R127.1 U39.14(Y1)
S2V5_2: R138.2 R139.1 U39.15(Y2)
S2V5_3: R150.2 R151.1 U39.12(Y3)
S2V5_4: R162.2 R163.1 U39.1(Y4)
S2V5_5: R176.2 R177.1 U39.5(Y5)
S2V5_6: R188.2 R189.1 U39.2(Y6)
S2V5_7: R200.2 R201.1 U39.4(Y7)
S3V0: U40.3(Z) ; off-sheet S3V0
S3V0_0: R116.2 R117.1 U40.13(Y0)
S3V0_1: R128.2 R129.1 U40.14(Y1)
S3V0_2: R140.2 R141.1 U40.15(Y2)
S3V0_3: R152.2 R153.1 U40.12(Y3)
S3V0_4: R164.2 R165.1 U40.1(Y4)
S3V0_5: R178.2 R179.1 U40.5(Y5)
S3V0_6: R190.2 R191.1 U40.2(Y6)
S3V0_7: R202.2 R203.1 U40.4(Y7)
S3V3: U41.3(Z) ; off-sheet S3V3
S3V3_0: R118.2 R119.1 U41.13(Y0)
S3V3_1: R130.2 R131.1 U41.14(Y1)
S3V3_2: R142.2 R143.1 U41.15(Y2)
S3V3_3: R154.2 R155.1 U41.12(Y3)
S3V3_4: R166.2 R167.1 U41.1(Y4)
S3V3_5: R180.2 R181.1 U41.5(Y5)
S3V3_6: R192.2 R193.1 U41.2(Y6)
S3V3_7: R204.2 R205.1 U41.4(Y7)
S5V0: U42.3(Z) ; off-sheet S5V0
S5V0_0: R120.2 R121.1 U42.13(Y0)
S5V0_1: R132.2 R133.1 U42.14(Y1)
S5V0_2: R144.2 R145.1 U42.15(Y2)
S5V0_3: R156.2 R157.1 U42.12(Y3)
S5V0_4: R168.2 R169.1 U42.1(Y4)
S5V0_5: R182.2 R183.1 U42.5(Y5)
S5V0_6: R194.2 R195.1 U42.2(Y6)
S5V0_7: R206.2 R207.1 U42.4(Y7)
SPDT_EN: U8.6(~{EN}) U9.6(~{EN}) U10.6(~{EN}) U11.6(~{EN}) U12.6(~{EN}) U13.6(~{EN}) U14.6(~{EN}) U15.6(~{EN}) U16.6(~{EN}) U17.6(~{EN}) U18.6(~{EN}) U19.6(~{EN}) U20.6(~{EN}) U21.6(~{EN}) U22.6(~{EN}) U23.6(~{EN}) U24.6(~{EN}) U25.6(~{EN}) U26.6(~{EN}) U27.6(~{EN}) U28.6(~{EN}) U29.6(~{EN}) U30.6(~{EN}) U31.6(~{EN}) U32.6(~{EN}) U33.6(~{EN}) U34.6(~{EN}) U35.6(~{EN}) U36.6(~{EN}) U37.6(~{EN}) U38.6(~{EN}) U39.6(~{EN}) U40.6(~{EN}) U41.6(~{EN}) U42.6(~{EN}) U43.6(~{EN}) U44.6(~{EN}) U45.6(~{EN}) ; off-sheet SPDT_EN
SPI1_CS: U29.3(Z) ; off-sheet SPI1_CS
SPI1_MISO: U26.3(Z) ; off-sheet SPI1_MISO
SPI1_MOSI: U27.3(Z) ; off-sheet SPI1_MOSI
SPI1_SCK: U28.3(Z) ; off-sheet SPI1_SCK
USART1_RX: U24.3(Z) ; off-sheet USART1_RX
USART1_TX: U25.3(Z) ; off-sheet USART1_TX

Not connected (* = marked no-connect by the designer): U51 2(RDY)* 6(AIN2)* 7(AIN3)*

## Notes on the sheet
- Logo:
- Product Title:
- Product Number:
- Mod Title:
- Size:
- Mod Number:
- A2
- SheetOf:
- Revision:
- DrawnBy:
- Date:
- CheckedBy:

## Library data of the parts
C22 C23 C130-C169 = 无极性电容
P8-P23 = Header 12X2: Header, 12-Pin, Dual row; LatestRevisionDate: 17-Jul-2002; LatestRevisionNote: Re-released for DXP Platform.; Publisher: Altium Limited
R16-R209 = 普通电阻
U8-U45 = 74HC4051
U50 = AMS1117